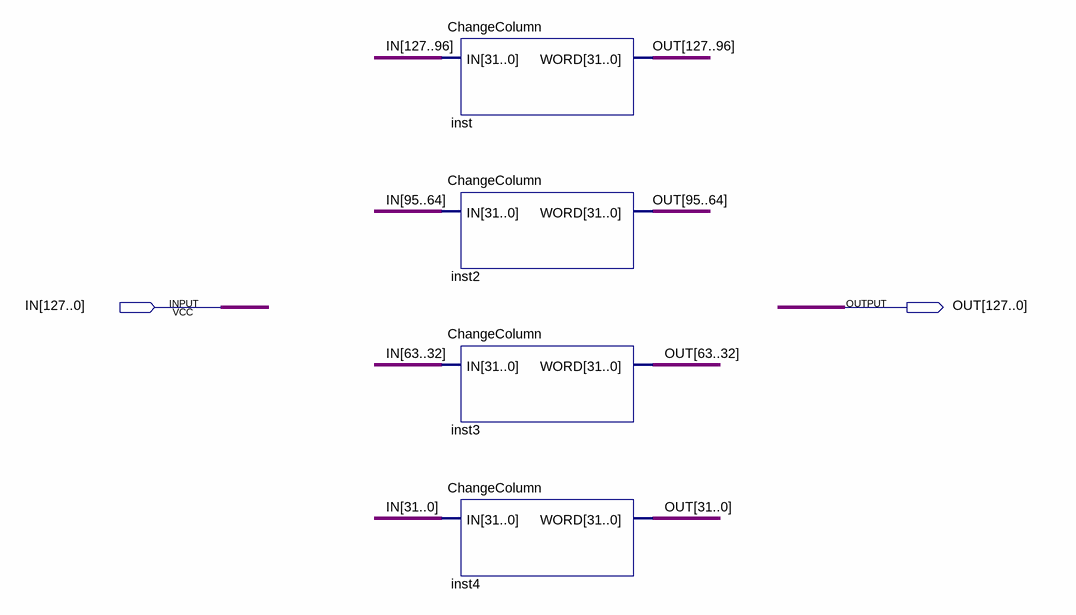
[diagram p0: schematic sheet]
// Quartus schematic MixColumns.bdf as structural Verilog: 4 symbols, 2 pins
module MixColumns (
  input  [127:0] IN,
  output [127:0] OUT
);

  ChangeColumn inst (.IN(IN[127:96]), .WORD(OUT[127:96]));
  ChangeColumn inst2 (.IN(IN[95:64]), .WORD(OUT[95:64]));
  ChangeColumn inst3 (.IN(IN[63:32]), .WORD(OUT[63:32]));
  ChangeColumn inst4 (.IN(IN[31:0]), .WORD(OUT[31:0]));
endmodule
